# EAGLE schematic relay (EAGLE 8.0.1)
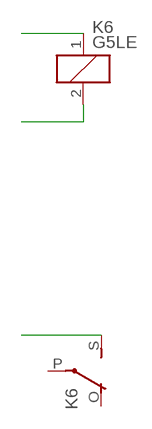
[diagram p0: schematic, sheet 1]

## Parts
K6  G5LE  [G5LE]

## Nets
5V-HV: K6.1
N$44: K6.2
N$47 [Massa]: K6.S(2:S)
Unconnected: K6.O(2:O) K6.P(2:P)

## Library data of the parts
K6 = relay:G5LE: RELAY 1 x switch, 10 A/120 V AC, 8 A/30 V DC, Omron; OC_FARNELL: unknown; OC_NEWARK: unknown

## Net classes
2 Massa: width 1.2 mm, drill 0.6 mm, clearance 0.2 mm